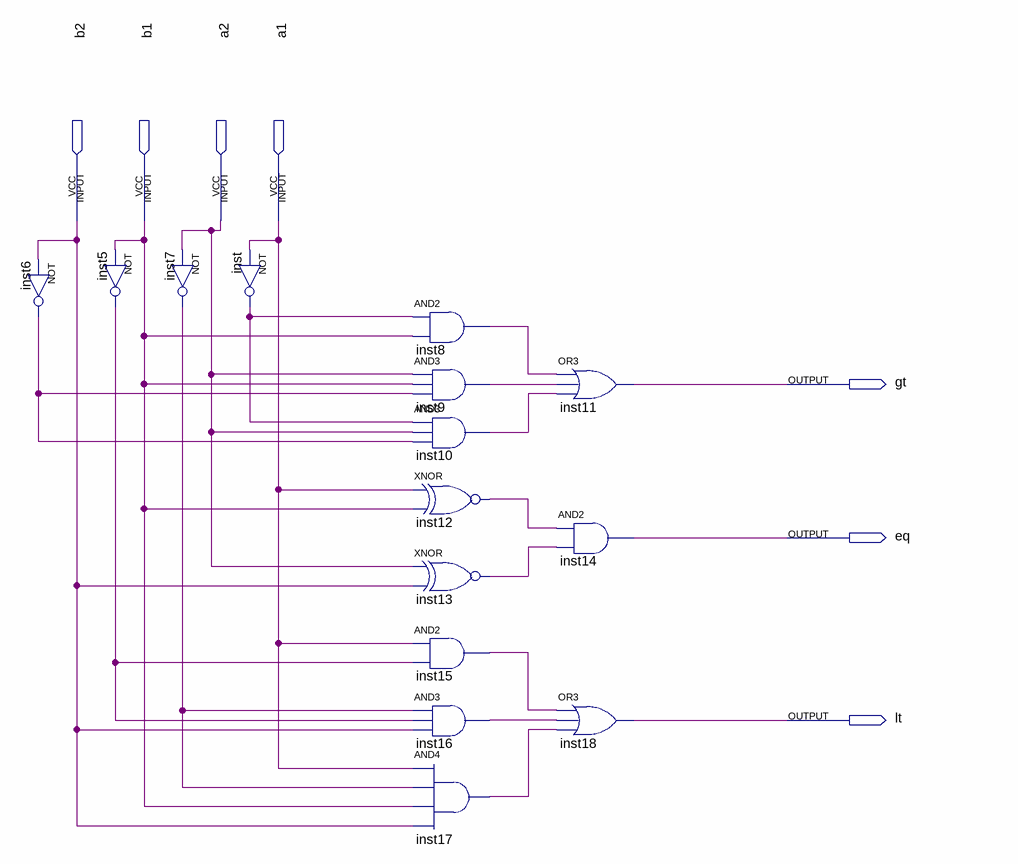
[diagram p0: schematic sheet]
// Quartus schematic LAB04.bdf as structural Verilog: 15 symbols, 7 pins
module LAB04 (
  input  b2,
  input  b1,
  input  a2,
  input  a1,
  output gt,
  output eq,
  output lt
);

  wire inst5_out, inst6_out, inst7_out, inst8_out, inst9_out, inst10_out, inst12_out, inst13_out, inst15_out,
       inst16_out, inst17_out, inst_out;

  not inst6 (inst6_out, b2);
  not inst5 (inst5_out, b1);
  not inst7 (inst7_out, a2);
  not inst (inst_out, a1);
  and inst8 (inst8_out, inst_out, b1);
  and inst9 (inst9_out, a2, b1, inst6_out);
  and inst10 (inst10_out, inst_out, a2, inst6_out);
  xnor inst12 (inst12_out, a1, b1);
  xnor inst13 (inst13_out, a2, b2);
  and inst15 (inst15_out, a1, inst5_out);
  and inst16 (inst16_out, inst7_out, inst5_out, b2);
  and inst17 (inst17_out, a1, inst7_out, b1, b2);
  or inst11 (gt, inst8_out, inst9_out, inst10_out);
  and inst14 (eq, inst12_out, inst13_out);
  or inst18 (lt, inst15_out, inst16_out, inst17_out);
endmodule
